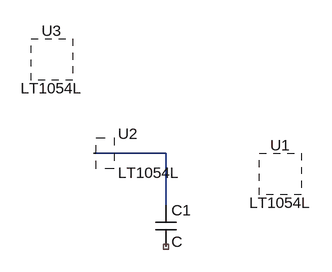
[diagram p0: schematic Domaci_1.asc]
Domaci_1.asc, the LTspice schematic file:
Version 4
SHEET 1 880 680
WIRE 176 144 64 144
WIRE 176 224 176 144
SYMBOL cap 160 224 R0
SYMATTR InstName C1
SYMBOL PowerProducts\\LT1054L 352 176 R0
SYMATTR InstName U1
SYMBOL PowerProducts\\LT1054L 16 288 R0
SYMATTR InstName U2
SYMBOL PowerProducts\\LT1054L 0 0 R0
SYMATTR InstName U3

The netlist it stands for:
* Domaci_1.asc
C1 N001 NC_01 C
* U1: LT1054L (symbol PowerProducts\LT1054L not available, pin order unknown); nets seen at it: 
* U2: LT1054L (symbol PowerProducts\LT1054L not available, pin order unknown); nets seen at it: N001
* U3: LT1054L (symbol PowerProducts\LT1054L not available, pin order unknown); nets seen at it: 
.backanno
.end